# Altium schematic sheet US_EPS_BIC.SchDoc
size A4
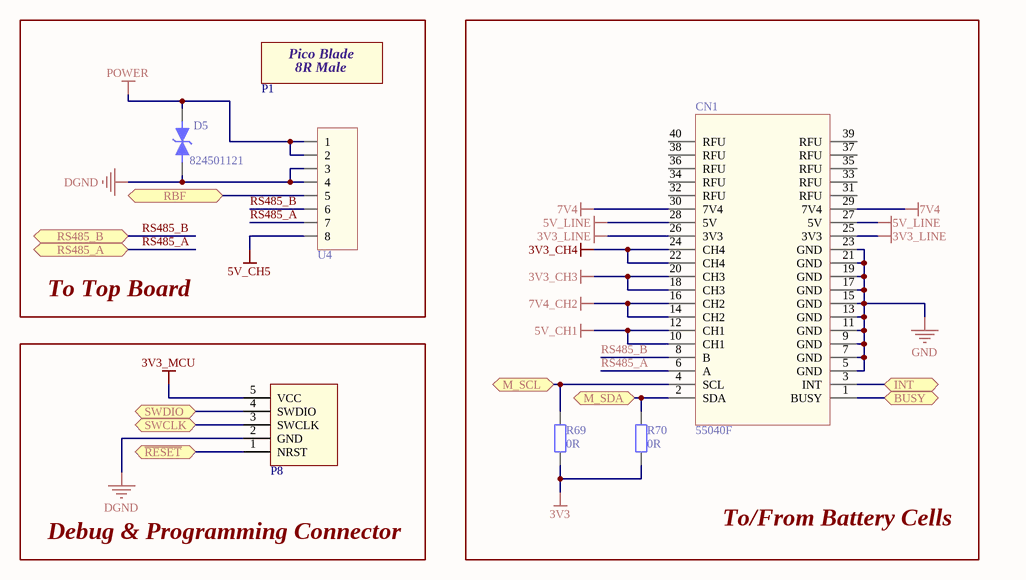
[diagram p0: US_EPS_BIC.SchDoc]

## Parts
CN1  55040F  [HEADER_40PIN_12MM2]
D5  824501121  [DIOM4227X25N]
P1  PicoBlade_8R_MALE  (value not drawn)  (mechanical)
P8  SWD  [SWD_CON_VAR1]  (value not drawn)  (no BOM)
R69  0R  [R0603_IPC_MD]  (no BOM)
R70  0R  [R0603_IPC_MD]  (no BOM)
U4  PicoBlade_8R  [PB_53398-0871_RIGHT]  (value not drawn)

## Blocks framed on the sheet
To Top Board: D5 P1 U4
To/From Battery Cells: CN1 R69 R70
Debug & Programming Connector: P8

## Ports
BUSY, INT, M_SCL, M_SDA, RBF, RS485_A (bidir), RS485_B (bidir), SWCLK, SWDIO, ~{RESET}

## Nets
3V3: R69.1 R70.1
3V3_CH3: CN1.18(CH3) CN1.20(CH3)
3V3_CH4: CN1.22(CH4) CN1.24(CH4)
3V3_LINE: CN1.25(3V3) CN1.26(3V3)
3V3_MCU: P8.5(VCC)
5V_CH1: CN1.10(CH1) CN1.12(CH1)
5V_CH5: U4.8
5V_LINE: CN1.27(5V) CN1.28(5V)
7V4: CN1.29(7V4) CN1.30(7V4)
7V4_CH2: CN1.14(CH2) CN1.16(CH2)
DGND: D5.1 P8.2(GND) U4.3 U4.4
GND: CN1.5(GND) CN1.7(GND) CN1.9(GND) CN1.11(GND) CN1.13(GND) CN1.15(GND) CN1.17(GND) CN1.19(GND) CN1.21(GND) CN1.23(GND)
POWER: D5.2 U4.1 U4.2
BUSY: CN1.1(BUSY) ; port BUSY
INT: CN1.3(INT) ; port INT
M_SCL: CN1.4(SCL) R69.2 ; port M_SCL
M_SDA: CN1.2(SDA) R70.2 ; port M_SDA
~{RESET}: P8.1(NRST) ; port ~{RESET}
RBF: U4.5 ; port RBF
RS485_A: CN1.6(A) U4.7 ; port RS485_A
RS485_B: CN1.8(B) U4.6 ; port RS485_B
SWCLK: P8.3(SWCLK) ; port SWCLK
SWDIO: P8.4(SWDIO) ; port SWDIO

Not connected (* = marked no-connect by the designer): CN1 31(RFU) 32(RFU) 33(RFU) 34(RFU) 35(RFU) 36(RFU) 37(RFU) 38(RFU) 39(RFU) 40(RFU)

## Notes on the sheet
- (in symbol PicoBlade_8R_M) Pico Blade; 8R Male

## Library data of the parts
CN1 = ALFASAT_BIC: CONN HEADER R/A 40POS 2.54MM; Manufacturer: On Shore Technology Inc.; Manufacturer Part Number: 55040F; Supplier 1: LCSC; Supplier Part Number 1: C35165
D5 = 824501121_TVS: TVS DIODE 12V 19.9V DO214AC; Manufacturer: Wurth Electronics Inc.; Voltage - Reverse Standoff (Typ): 12V (Max); Current - Average Rectified (Io): 1A; Manufacturer Part Number: 824501121; Supplier 1: Digi-Key; Supplier Part Number 1: 732-9949-1-ND
P1 = PicoBlade_8R_M: MALE Connector Header Surface Mount, Right Angle 8 position 0.049" (1.25mm); Manufacturer: China; Manufacturer Part Number: PicoBlade_8R_MALE; Supplier 1: Aliexpress; Supplier Part Number 1: PicoBlade_8R_M
P8 = SWD-CONNECTOR_VAR1: SWDIO SWCLK VDD GND NRST; Manufacturer: *; Manufacturer Part Number: *; Supplier 1: *; Supplier Part Number 1: *
R69 R70 = CR0603-J/-000ELF: RES SMD 0 OHM JUMPER 1/10W 0603; Manufacturer: Bourns Inc.; Tolarance: 1%; Value: 0R; Manufacturer Part Number: CR0603-J/-000ELF; Supplier 1: Digi-Key; Supplier Part Number 1: CR0603-J/-000ELFCT-ND
U4 = PicoBlade_8R: Connector Header Surface Mount, Right Angle 8 position 0.049" (1.25mm); Manufacturer: China; Manufacturer Part Number: PicoBlade_8R; Supplier 1: Aliexpress; Supplier Part Number 1: PicoBlade_8R